# Altium schematic sheet analog.SchDoc
size A4; Date: 08.06.2024; ApprovedBy: Jan Macheta; Author: Mikołaj Pichita; SheetNumber: 4; SheetTotal: 8
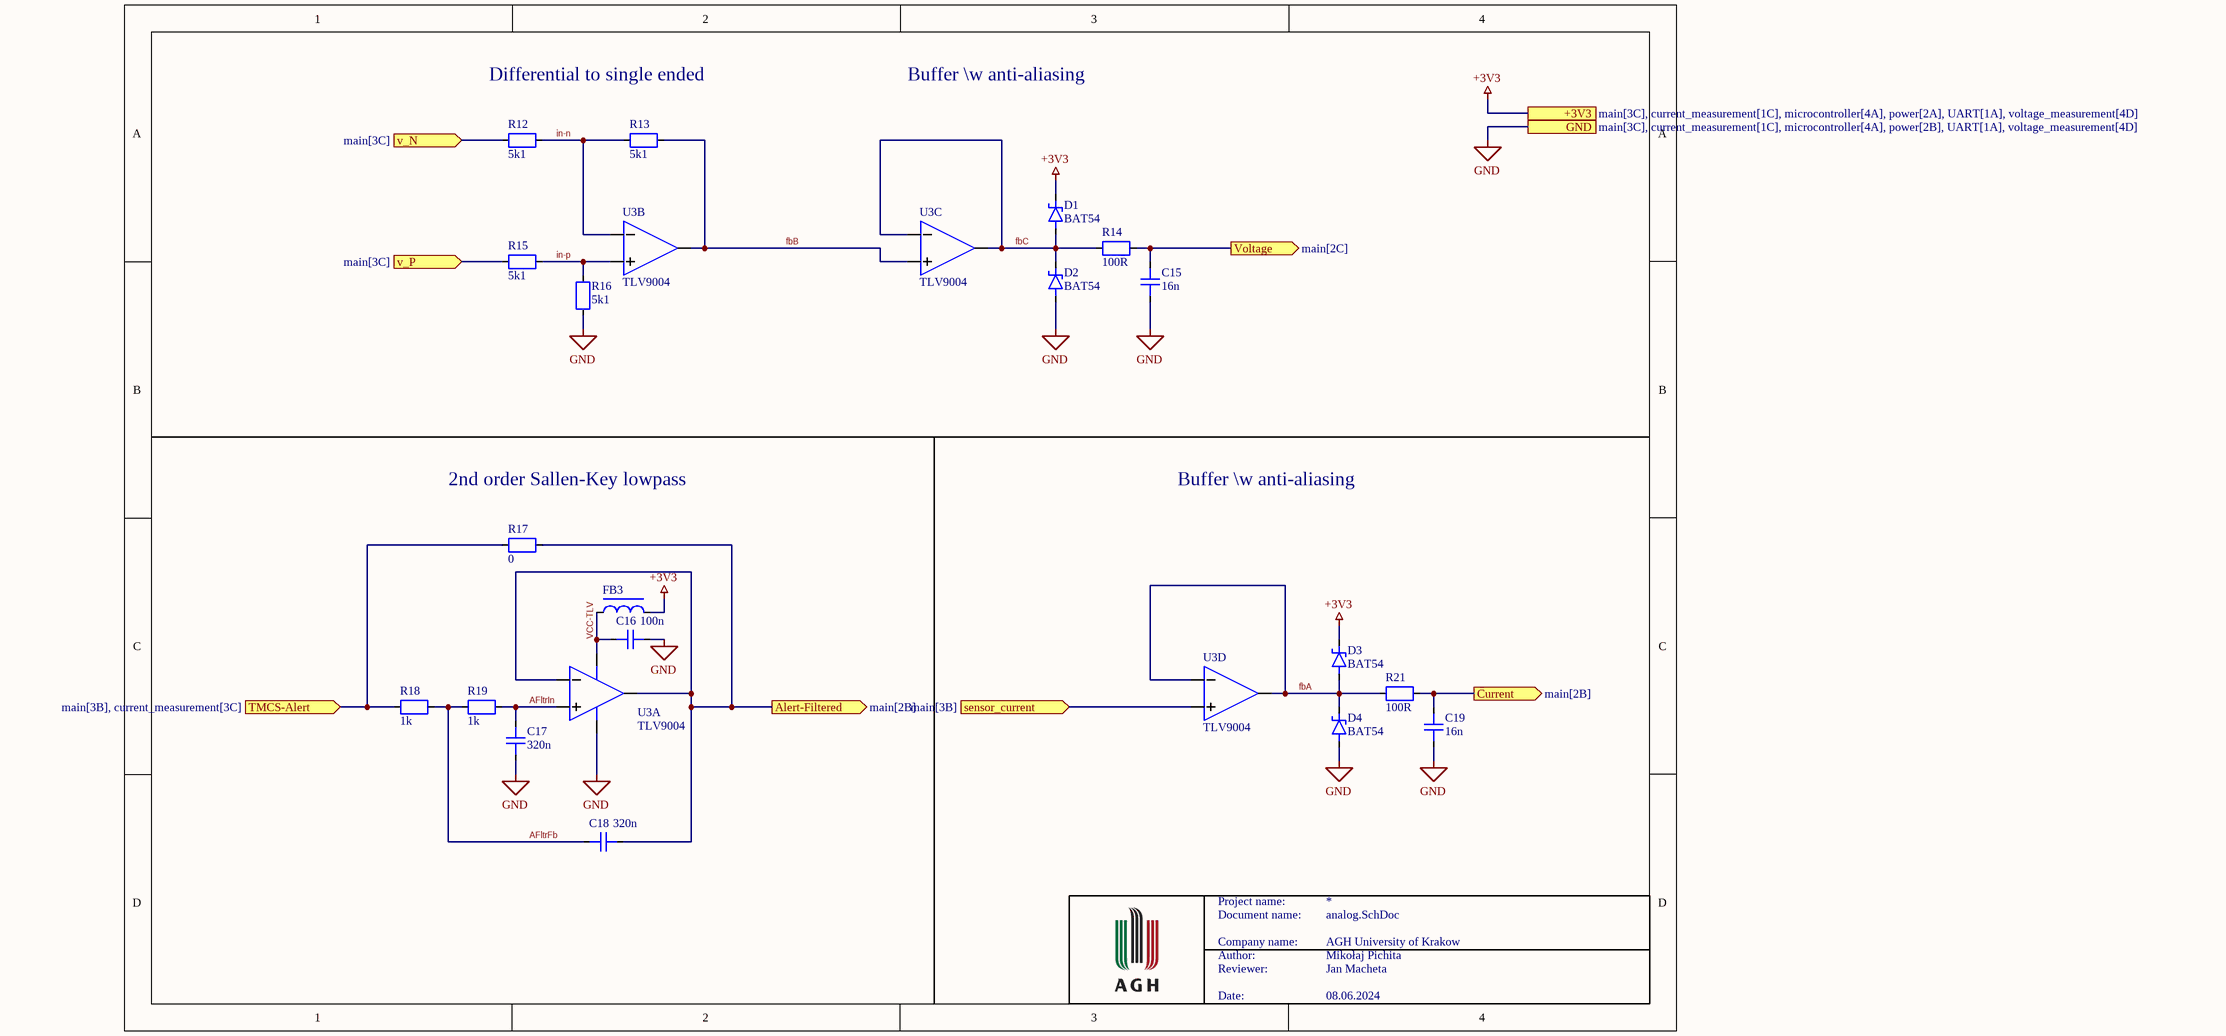
[diagram p0: analog.SchDoc]

## Parts
C15  16n  [CAP0603]
C16  100n  [CAP0603]
C17  320n  [CAP0603]
C18  320n  [CAP0603]
C19  16n  [CAP0603]
D1  BAT54  [INF-SC79_V]
D2  BAT54  [INF-SC79_V]
D3  BAT54  [INF-SC79_V]
D4  BAT54  [INF-SC79_V]
FB3  *  [FB0402]  (value not drawn)
R12  5k1  [RES0603]
R13  5k1  [RES0603]
R14  100R  [RES0603]
R15  5k1  [RES0603]
R16  5k1  [RES0603]
R17  0  [RES0603]
R18  1k  [RES0603]
R19  1k  [RES0603]
R21  100R  [RES0603]
U3  TLV9004  [TSSOP50P330X110-14N]  (parts A,B,C,D of 4)

## Ports
+3V3 (see main[3C], current_measurement[1C], microcontroller[4A], power[2A], UART[1A], voltage_measurement[4D]), Alert-Filtered (out, see main[2B]), Current (out, see main[2B]), GND (see main[3C], current_measurement[1C], microcontroller[4A], power[2B], UART[1A], voltage_measurement[4D]), sensor_current (in, see main[3B]), TMCS-Alert (in, see main[3B], current_measurement[3C]), v_N (in, see main[3C]), v_P (in, see main[3C]), Voltage (out, see main[2C])

## Nets
+3V3: D1.1(Cathode) D3.1(Cathode) FB3.2 ; port +3V3
GND: C15.2 C16.2 C17.2 C19.2 D2.2(Anode) D4.2(Anode) R16.2 U3.11(V-) ; port GND
AFltrFb: C18.1 R18.1 R19.2
AFltrIn: C17.1 R19.1 U3.3(IN1+)
Alert-Filtered: C18.2 R17.1 U3.1(OUT1) U3.2(IN1-) ; port Alert-Filtered
Current: C19.1 R21.1 ; port Current
fbA: D3.2(Anode) D4.1(Cathode) R21.2 U3.13(IN4-) U3.14(OUT4)
fbB: R13.2 U3.7(OUT2) U3.10(IN3+)
fbC: D1.2(Anode) D2.1(Cathode) R14.2 U3.8(OUT3) U3.9(IN3-)
in-n: R12.2 R13.1 U3.6(IN2-)
in-p: R15.2 R16.1 U3.5(IN2+)
sensor_current: U3.12(IN4+) ; port sensor_current
TMCS-Alert: R17.2 R18.2 ; port TMCS-Alert
v_N: R12.1 ; port v_N
v_P: R15.1 ; port v_P
VCC-TLV: C16.1 FB3.1 U3.4(V+)
Voltage: C15.1 R14.1 ; port Voltage

## Notes on the sheet
- Differential to single ended
- Buffer \w anti-aliasing
- 2nd order Sallen-Key lowpass
- Project name:
- Document name:
- Company name:
- Author:
- Reviewer:
- AGH University of Krakow
- Date:

## Library data of the parts
C15-C19 = Capacitor: Value: *; HelpURL: *; MPN: *; Supplier: *; SupplierPartNumber: *
D1-D4 = Schottky: Value: *; HelpURL: *; MPN: *; Supplier: *; SupplierPartNumber: *
FB3 = Ferrite Bead: Value: *; HelpURL: *; MPN: *; Supplier: *; SupplierPartNumber: *
R12-R19 R21 = Resistor: Value: *; HelpURL: *; MPN: *; Supplier: *; SupplierPartNumber: *
U3 = TLV9004: Operational Amplifiers - Op Amps Quad, 5.5-V, 1-MHz, RRIO operational amplifier for cost-optimized applications 14-SOT-23-THIN -40 to 125; Value: *; HelpURL: *; MPN: *; Supplier: *; SupplierPartNumber: *